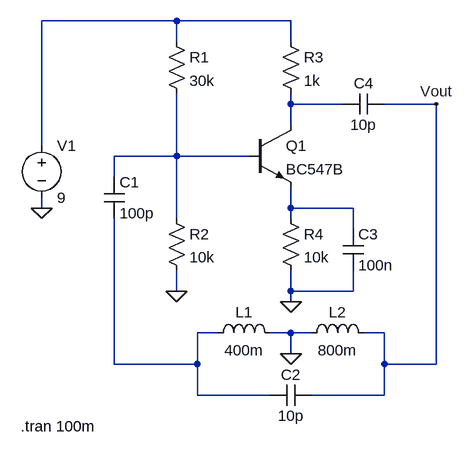
[diagram p0: schematic hartley_osc_.asc]
hartley_osc_.asc, the LTspice schematic file:
Version 4
SHEET 1 880 680
WIRE 352 -48 144 -48
WIRE 528 -48 352 -48
WIRE 352 -16 352 -48
WIRE 528 -16 528 -48
WIRE 528 80 528 64
WIRE 608 80 528 80
WIRE 752 80 672 80
WIRE 528 112 528 80
WIRE 144 144 144 -48
WIRE 352 160 352 64
WIRE 352 160 256 160
WIRE 464 160 352 160
WIRE 256 192 256 160
WIRE 144 240 144 224
WIRE 528 240 528 208
WIRE 624 240 528 240
WIRE 352 256 352 160
WIRE 528 256 528 240
WIRE 624 272 624 240
WIRE 352 368 352 336
WIRE 528 368 528 336
WIRE 624 368 624 336
WIRE 624 368 528 368
WIRE 528 384 528 368
WIRE 416 432 384 432
WIRE 528 432 496 432
WIRE 560 432 528 432
WIRE 672 432 640 432
WIRE 528 464 528 432
WIRE 256 480 256 256
WIRE 384 480 384 432
WIRE 384 480 256 480
WIRE 672 480 672 432
WIRE 752 480 752 80
WIRE 752 480 672 480
WIRE 384 528 384 480
WIRE 496 528 384 528
WIRE 672 528 672 480
WIRE 672 528 560 528
FLAG 144 240 0
FLAG 352 368 0
FLAG 528 384 0
FLAG 528 464 0
FLAG 752 80 Vout
SYMBOL voltage 144 128 R0
WINDOW 123 0 0 Left 0
WINDOW 39 0 0 Left 0
SYMATTR InstName V1
SYMATTR Value 9
SYMBOL res 336 -32 R0
SYMATTR InstName R1
SYMATTR Value 30k
SYMBOL res 336 240 R0
SYMATTR InstName R2
SYMATTR Value 10k
SYMBOL cap 240 192 R0
SYMATTR InstName C1
SYMATTR Value 100p
SYMBOL res 512 240 R0
SYMATTR InstName R4
SYMATTR Value 10k
SYMBOL npn 464 112 R0
SYMATTR InstName Q1
SYMATTR Value BC547B
SYMBOL cap 672 64 R90
WINDOW 0 0 32 VBottom 2
WINDOW 3 32 32 VTop 2
SYMATTR InstName C4
SYMATTR Value 10p
SYMBOL ind 400 448 R270
WINDOW 0 32 56 VTop 2
WINDOW 3 5 56 VBottom 2
SYMATTR InstName L1
SYMATTR Value 400m
SYMBOL ind 544 448 R270
WINDOW 0 32 56 VTop 2
WINDOW 3 5 56 VBottom 2
SYMATTR InstName L2
SYMATTR Value 800m
SYMBOL cap 560 512 R90
WINDOW 0 0 32 VBottom 2
WINDOW 3 32 32 VTop 2
SYMATTR InstName C2
SYMATTR Value 10p
SYMBOL res 512 -32 R0
SYMATTR InstName R3
SYMATTR Value 1k
SYMBOL cap 608 272 R0
SYMATTR InstName C3
SYMATTR Value 100n
TEXT 112 576 Left 2 !.tran 100m

The netlist it stands for:
* hartley_osc_.asc
V1 N001 0 9
R1 N001 N003 30k
R2 N003 0 10k
C1 N003 N005 100p
R4 N004 0 10k
Q1 N002 N003 N004 0 BC547B
C4 Vout N002 10p
L1 N005 0 400m
L2 0 Vout 800m
C2 Vout N005 10p
R3 N001 N002 1k
C3 N004 0 100n
.model NPN NPN
.model PNP PNP
.lib standard.bjt
.tran 100m
.backanno
.end